# Altium schematic sheet PIR Sensor driver v5.1-Cheburan.SchDoc: PIR Universal Interface Board
size A4; Version: 5.1; Variant: Driver for PIR 501 Sensor; Modification: Mod; Project: Sensors; PageSetup: Record=PageOptions|CenterHorizontal=True|CenterVertical=True|PrintScale=0.97|XCorrection=1.00|YCorrection=1.00|PrintKind=1|BorderSize=5000000|LeftOffset=0|BottomOffset=0|Orientation=2|PaperLength=2970|PaperWidth=2100|Scale=100|PaperSource=7|PrintQuality=-4|MediaType=1|DitherType=10|PaperKind=A4|PrintScaleMode=1
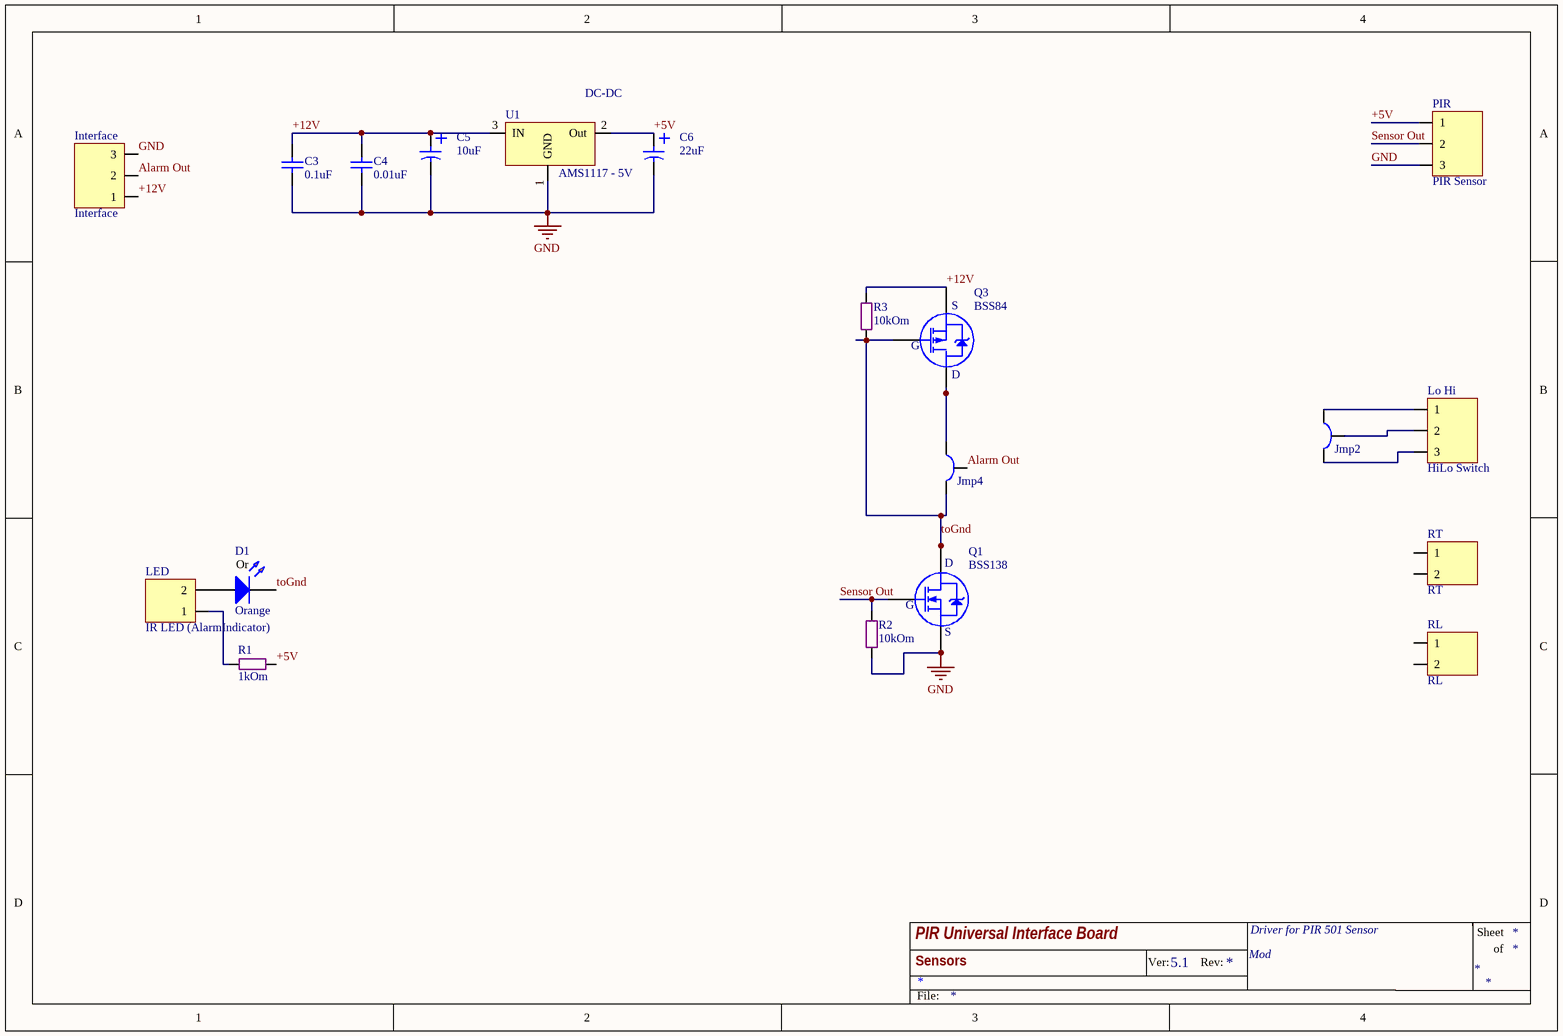
[diagram p0: PIR Sensor driver v5.1-Cheburan.SchDoc]

## Parts
C3  0.1uF  [SMD 0805 (2012)]
C4  0.01uF  [SMD 0805 (2012)]
C5  10uF  [SMD 1206 Tantal (3216)]
C6  22uF  [SMD 3528 Tantal (1210)]
D1  Orange  [LED SMD 1206-0805 Orange]
Interface  Interface  [Line 2.54 X 3]
Jmp2  Jumper_3pos  [Jumper 3pos ws Holes]  (value not drawn)
Jmp4  Jumper_3pos  [Jumper 3pos ws Holes]  (value not drawn)
LED  IR LED (AlarmIndicator)  [Line 2.54 x 2]
Lo_Hi  HiLo Switch  [Line 2.54 X 3]
PIR  PIR Sensor  [Line 2.54 X 3]
Q1  BSS138  [SOT-23]
Q3  BSS84  [SOT-23]
R1  1kOm  [SMD 0805 (2012)]
R2  10kOm  [SMD 0805 (2012)]
R3  10kOm  [SMD 0805 (2012)]
RL  RL  [Line 2.54 x 2]
RT  RT  [Line 2.54 x 2]
U1  AMS1117 - 5V  [SOT-223-3 (AMS)]

## Nets
GND: C3.2 C4.2 C5.GND C6.GND Interface.3 PIR.3 Q1.2(S) R2.1 U1.1(GND)
+5V: C6.VCC PIR.1 R1.1 U1.2(Out)
+12V: C3.1 C4.1 C5.VCC Interface.1 Q3.2(S) R3.2 U1.3(IN)
Alarm Out: Interface.2 Jmp4.2
Sensor Out: PIR.2 Q1.1(G) R2.2
toGnd: D1.K Jmp4.3 Q1.3(D) Q3.1(G) R3.1
NetD1_A: D1.A LED.2
NetJmp2_1: Jmp2.1 Lo_Hi.1
NetJmp2_2: Jmp2.2 Lo_Hi.2
NetJmp2_3: Jmp2.3 Lo_Hi.3
NetJmp4_1: Jmp4.1 Q3.3(D)
NetLED_1: LED.1 R1.2

Not connected (* = marked no-connect by the designer): RL 1 2; RT 1 2

## Notes on the sheet
- (near U1) DC-DC
- Ver:
- Rev:
- Sheet
- of
- File:
- (in symbol Led SMD Orange) Or

## Library data of the parts
C3 C4 = Cap SMD 0402-1812: Capacitor
C5 C6 = Cap Tantal: Capacitor
D1 = Led SMD Orange: ?2v ?20mA; Forward Voltage TYP: ?2; Resistor for 5v VCC: 330 Om; Forward Voltage Min: ?; Wave len min/typ: ?; Liminous Min (mcd): ?; Liminous Typ (mcd): ?; Forward Amp (mA): ?; Color: Orange
Interface Lo_Hi PIR = PLS-3: Vert, Sgl line, Male
LED RL RT = PLS-2: Vert, Sgl line, Male
Q1 = BSS138: N-Channel 50V - 0.7-1Ω - 0.22A; Monufacturer: Farchild; V DSS (v): 60; RDS: <6Om; I d - Drain current (continuous) at TC = 100°C: 50 A; I d - Drain current (continuous) at TC = 25°C: 0.22 A; Name: BSS138; Datasheet: http://tec.org.ru/board/0-0-0-511-20
Q3 = BSS84: P-Channel -50V - 10-1Ω - 0.13A; Monufacturer: Farchild; V DSS (v): 60; RDS: <10Om; Open Voltage: -0.8...-2.0 V; I d - Drain current (continuous) at TC = 25°C: 0.13 A; Name: BSS84; Datasheet: http://tec.org.ru/board/0-0-0-515-20
R1-R3 = Res All Types
U1 = AMS1117_FIX: Voltage Regulator SOT-223-3; I output (A): 1; Max Voltage In (V): 15; t: -40...+125°C; Name: AMS1117 1.5 / 1.8 / 2.5 / 2.85 / 3.3 / 5.0; Dropuot: 1-1.3V; Capacitors: In: 10mF; Out: 22mF; V Out: 1.5 / 1.8 / 2.5 / 2.85 / 3.3 / 5.0; Case: SOT-223; Dtatsheet: https://lib.chipdip.ru/029/DOC001029248.pdf